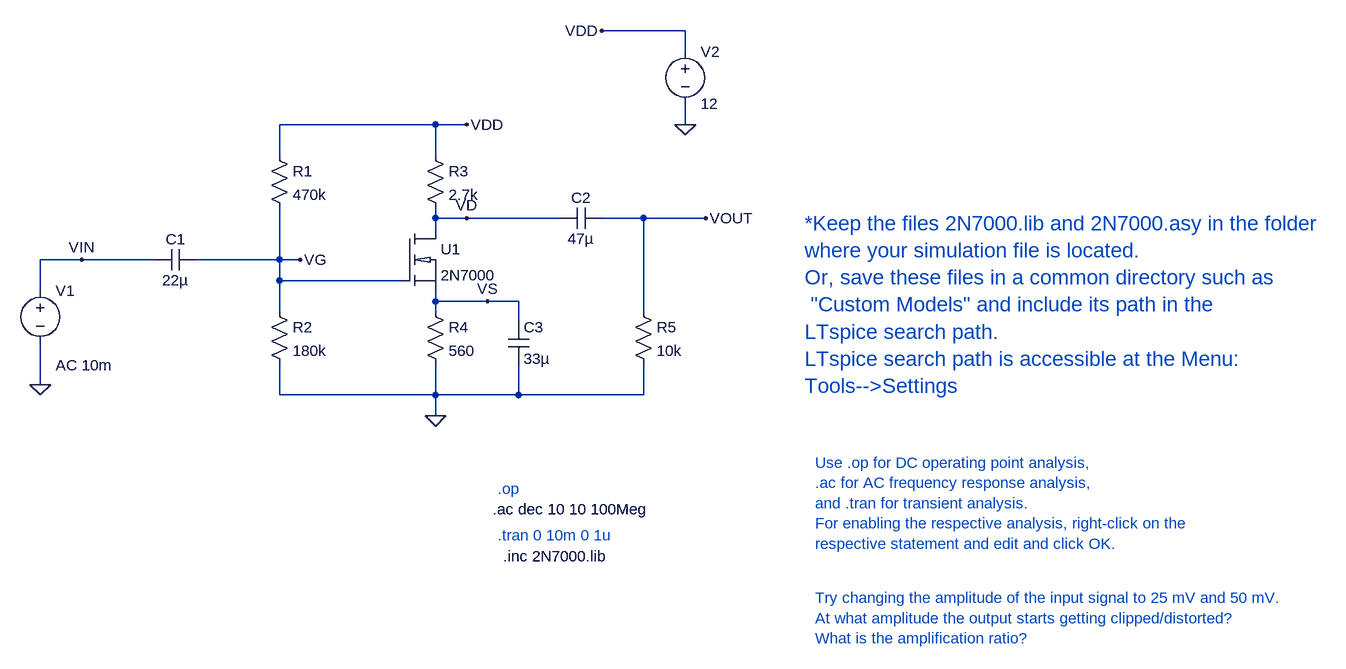
[diagram p0: schematic Demo_MOSFET_CS_Amplifier.asc]
Demo_MOSFET_CS_Amplifier.asc, the LTspice schematic file:
Version 4.1
SHEET 1 1760 752
WIRE 512 -208 384 -208
WIRE 512 -176 512 -208
WIRE 128 -64 -112 -64
WIRE 176 -64 128 -64
WIRE 512 -64 512 -96
WIRE -112 -16 -112 -64
WIRE 128 -16 128 -64
WIRE 128 80 128 64
WIRE 176 80 128 80
WIRE 320 80 176 80
WIRE 448 80 384 80
WIRE 544 80 448 80
WIRE 128 96 128 80
WIRE -416 144 -480 144
WIRE -304 144 -416 144
WIRE -112 144 -112 64
WIRE -112 144 -240 144
WIRE -80 144 -112 144
WIRE -112 176 -112 144
WIRE 80 176 -112 176
WIRE -480 192 -480 144
WIRE 128 208 128 192
WIRE 208 208 128 208
WIRE 256 208 208 208
WIRE -112 224 -112 176
WIRE 128 224 128 208
WIRE 448 224 448 80
WIRE 256 240 256 208
WIRE -480 336 -480 272
WIRE -112 352 -112 304
WIRE 128 352 128 304
WIRE 128 352 -112 352
WIRE 256 352 256 304
WIRE 256 352 128 352
WIRE 448 352 448 304
WIRE 448 352 256 352
WIRE 128 384 128 352
FLAG -480 336 0
FLAG 512 -64 0
FLAG 128 384 0
FLAG 384 -208 VDD
FLAG 176 -64 VDD
FLAG 544 80 VOUT
FLAG -416 144 VIN
FLAG 208 208 VS
FLAG 176 80 VD
FLAG -80 144 VG
SYMBOL res -128 -32 R0
SYMATTR InstName R1
SYMATTR Value 470k
SYMBOL res -128 208 R0
SYMATTR InstName R2
SYMATTR Value 180k
SYMBOL res 112 -32 R0
SYMATTR InstName R3
SYMATTR Value 2.7k
SYMBOL res 112 208 R0
SYMATTR InstName R4
SYMATTR Value 560
SYMBOL res 432 208 R0
SYMATTR InstName R5
SYMATTR Value 10k
SYMBOL voltage -480 176 R0
WINDOW 123 24 130 Left 2
WINDOW 39 0 0 Left 0
WINDOW 3 24 96 Invisible 2
SYMATTR Value2 AC 10m
SYMATTR Value SINE(0mV 25mV 1k 0 0 0 0)
SYMATTR InstName V1
SYMBOL cap -304 160 R270
WINDOW 0 32 32 VTop 2
WINDOW 3 0 32 VBottom 2
SYMATTR InstName C1
SYMATTR Value 22µ
SYMBOL cap 320 96 R270
WINDOW 0 32 32 VTop 2
WINDOW 3 0 32 VBottom 2
SYMATTR InstName C2
SYMATTR Value 47µ
SYMBOL cap 240 240 R0
SYMATTR InstName C3
SYMATTR Value 33µ
SYMBOL voltage 512 -192 R0
WINDOW 123 0 0 Left 0
WINDOW 39 0 0 Left 0
SYMATTR InstName V2
SYMATTR Value 12
SYMBOL devices\\2N7000 80 96 R0
SYMATTR InstName U1
TEXT 224 568 Left 2 ;.tran 0 10m 0 1u
TEXT 224 496 Left 2 ;.op
TEXT 216 528 Left 2 !.ac dec 10 10 100Meg
TEXT 232 600 Left 2 !.inc 2N7000.lib
TEXT 696 88 Left 3 ;*Keep the files 2N7000.lib and 2N7000.asy in the folder \nwhere your simulation file is located.\nOr, save these files in a common directory such as\n "Custom Models" and include its path in the \nLTspice search path.\nLTspice search path is accessible at the Menu:\nTools-->Settings
TEXT 712 456 Left 2 ;Use .op for DC operating point analysis,\n.ac for AC frequency response analysis,\nand .tran for transient analysis.\nFor enabling the respective analysis, right-click on the\nrespective statement and edit and click OK.
TEXT 712 664 Left 2 ;Try changing the amplitude of the input signal to 25 mV and 50 mV. \nAt what amplitude the output starts getting clipped/distorted?\nWhat is the amplification ratio?

The netlist it stands for:
* Demo_MOSFET_CS_Amplifier.asc
R1 VDD VG 470k
R2 VG 0 180k
R3 VDD VD 2.7k
R4 VS 0 560
R5 VOUT 0 10k
V1 VIN 0 SINE(0mV 25mV 1k 0 0 0 0) AC 10m
C1 VIN VG 22µ
C2 VD VOUT 47µ
C3 VS 0 33µ
V2 VDD 0 12
X§U1 VD VG VS 2N7000  ; pins DRAIN GATE SOURCE
* .tran 0 10m 0 1u
* .op
.ac dec 10 10 100Meg
.inc 2N7000.lib
* *Keep the files 2N7000.lib and 2N7000.asy in the folder
* where your simulation file is located.
* Or, save these files in a common directory such as
*  "Custom Models" and include its path in the
* LTspice search path.
* LTspice search path is accessible at the Menu:
* Tools-->Settings
* Use .op for DC operating point analysis,
* .ac for AC frequency response analysis,
* and .tran for transient analysis.
* For enabling the respective analysis, right-click on the
* respective statement and edit and click OK.
* Try changing the amplitude of the input signal to 25 mV and 50 mV.
* At what amplitude the output starts getting clipped/distorted?
* What is the amplification ratio?
.backanno
.end